# Altium schematic sheet Sheet3.SchDoc
size B; SheetNumber: 1; SheetTotal: 1
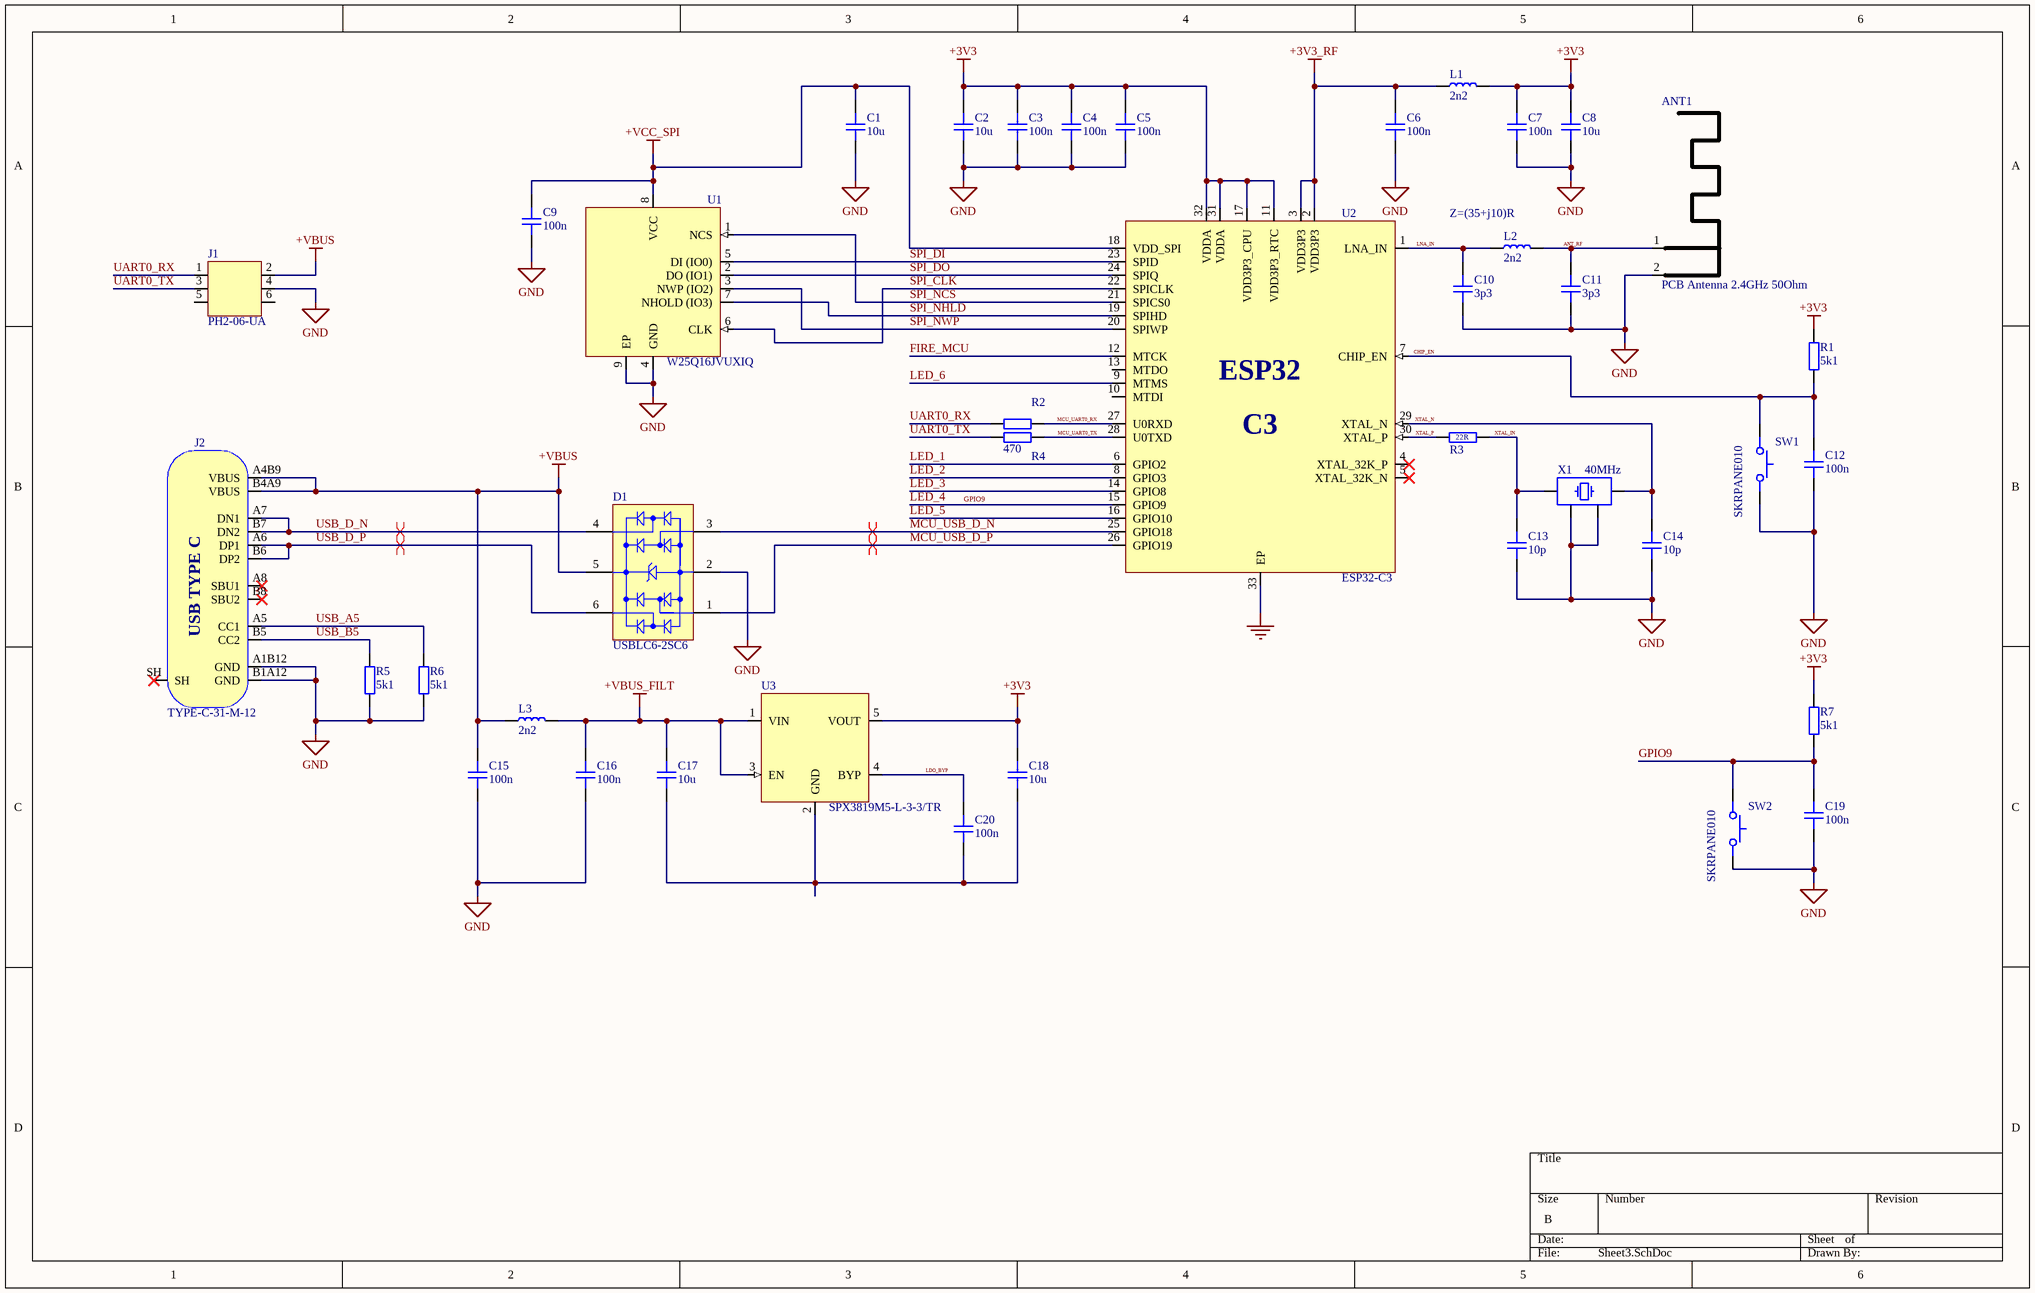
[diagram p0: Sheet3.SchDoc]

## Parts
ANT1  PCB Antenna 2.4GHz 50Ohm  [ANT_IFA_USB_2_4GHZ_50R]  (no BOM)
C1  10u  [CAP_0603]
C2  10u  [CAP_0603]
C3  100n  [CAP_0805]
C4  100n  [CAP_0805]
C5  100n  [CAP_0805]
C6  100n  [CAP_0805]
C7  100n  [CAP_0805]
C8  10u  [CAP_0603]
C9  100n  [CAP_0805]
C10  3p3  [CAP_0402]
C11  3p3  [CAP_0402]
C12  100n  [CAP_0805]
C13  10p  [CAP_0402]
C14  10p  [CAP_0402]
C15  100n  [CAP_0805]
C16  100n  [CAP_0805]
C17  10u  [CAP_0603]
C18  10u  [CAP_0603]
C19  100n  [CAP_0805]
C20  100n  [CAP_0805]
D1  USBLC6-2SC6  [STM-SOT23-6L_V]
J1  PH2-06-UA  [PH2-06-UA]
J2  TYPE-C-31-M-12  [TYPE-C-31-M-12]
L1  2n2  [IND_0402]
L2  2n2  [IND_0402]
L3  2n2  [IND_0402]
R1  5k1  [RES_0805]
R2  470  [RES_0805]  (value not drawn)
R3  22R  [RES_0402]
R4  470  [RES_0805]
R5  5k1  [RES_0805]
R6  5k1  [RES_0805]
R7  5k1  [RES_0805]
SW1  SKRPANE010  [SKRPANE010]
SW2  SKRPANE010  [SKRPANE010]
U1  W25Q16JVUXIQ  [USON-8-2X3MM]
U2  ESP32-C3  [QFN32-5x5]
U3  SPX3819M5-L-3-3/TR  [SOT-23-5]
X1  40MHz  [XTAL_2520]

## Nets
+3V3: C2.2 C3.2 C4.2 C5.2 C7.2 C8.2 C18.2 L1.1 R1.2 R7.2 U2.11(VDD3P3_RTC) U2.17(VDD3P3_CPU) U2.31(VDDA) U2.32(VDDA) U3.5(VOUT)
+3V3_RF: C6.2 L1.2 U2.2(VDD3P3) U2.3(VDD3P3)
+VBUS: C15.2 D1.5(VBUS) J1.2 J2.A4B9(VBUS) J2.B4A9(VBUS) L3.2
+VBUS_FILT: C16.2 C17.2 L3.1 U3.1(VIN) U3.3(EN)
+VCC_SPI: C1.2 C9.2 U1.8(VCC) U2.18(VDD_SPI)
GND: ANT1.2(GND) C1.1 C2.1 C3.1 C4.1 C5.1 C6.1 C7.1 C8.1 C9.1 C10.1 C11.1 C12.1 C13.1 C14.1 C15.1 C16.1 C19.1 D1.2(GND) J1.4 J2.A1B12(GND) J2.B1A12(GND) R5.1 R6.1 SW1.12 SW2.12 U1.4(GND) U1.9(EP) U2.33(EP) X1.2 X1.4
ANT_RF: ANT1.1(RF) C11.2 L2.1
CHIP_EN: C12.2 R1.1 SW1.34 U2.7(CHIP_EN)
FIRE_MCU: U2.12(MTCK)
GPIO9: C19.2 R7.1 SW2.34 U2.15(GPIO9)  [also labelled LED_4]
LDO_BYP: C20.2 U3.4(BYP)
LED_1: U2.6(GPIO2)
LED_2: U2.8(GPIO3)
LED_3: U2.14(GPIO8)
LED_5: U2.16(GPIO10)
LED_6: U2.9(MTMS)
LNA_IN: C10.2 L2.2 U2.1(LNA_IN)
MCU_UART0_RX: R2.1 U2.27(U0RXD)
MCU_UART0_TX: R4.1 U2.28(U0TXD)
MCU_USB_D_N: D1.3(I/O_2) U2.25(GPIO18)
MCU_USB_D_P: D1.1(I/O_1) U2.26(GPIO19)
SPI_CLK: U1.6(CLK) U2.22(SPICLK)
SPI_DI: U1.5(DI_(IO0)) U2.23(SPID)
SPI_DO: U1.2(DO_(IO1)) U2.24(SPIQ)
SPI_NCS: U1.1(NCS) U2.21(SPICS0)
SPI_NHLD: U1.7(NHOLD_(IO3)) U2.19(SPIHD)
SPI_NWP: U1.3(NWP_(IO2)) U2.20(SPIWP)
UART0_RX: J1.1 R2.2
UART0_TX: J1.3 R4.2
USB_A5: J2.A5(CC1) R6.2
USB_B5: J2.B5(CC2) R5.2
USB_D_N: D1.4(I/O_3) J2.A7(DN1) J2.B7(DN2)
USB_D_P: D1.6(I/O_4) J2.A6(DP1) J2.B6(DP2)
XTAL_IN: C13.2 R3.2 X1.3
XTAL_N: C14.2 U2.29(XTAL_N) X1.1
XTAL_P: R3.1 U2.30(XTAL_P)
NetC17_1: C17.1 C18.1 C20.1 U3.2(GND)

Not connected (* = marked no-connect by the designer): J1 5 6; J2 A8(SBU1)* B8(SBU2)* SH*; U2 4(XTAL_32K_P)* 5(XTAL_32K_N)* 10(MTDI) 13(MTDO)

## Layout directives
differential pair; differential pair class DIFF_USB: MCU_USB_D_N, MCU_USB_D_P, USB_D_N, USB_D_P

## Notes on the sheet
- (near L2) Z=(35+j10)R
- (in symbol ESP32-C3) ESP32; C3
- (in symbol TYPE-C-31-M-12) USB TYPE C

## Library data of the parts
ANT1 = ANT_IFA_USB_2_4GHZ_50R: Inverted F 2.4GHz ISM PCB Antenna 50 Ohm; ComponentLink1Description: Datasheet; ComponentLink1URL: https://www.ti.com/lit/an/swra117d/swra117d.pdf
C1 C2 C8 C17 C18 = CAP_0603_10V: Capacitor SMD 0603 10V; Manufacturer: Samsung; Manufacturer Part Number: CL10A106KP8NNNC; LCSC: C19702
C3-C7 C9 C12 C15 C16 C19 C20 = CAP_0805_50V: Capacitor SMD 0805 50V
C10 C11 = CAP_0402_50V: Capacitor SMD 0402 50V; Manufacturer: FH; Manufacturer Part Number: 0402CG3R3C500NT; LCSC: C1565
C13 C14 = CAP_0402_50V: Capacitor SMD 0402 50V; Manufacturer: Samsung; Manufacturer Part Number: CL05C100JB5NNNC; LCSC: C32949
D1 = CMP-2000-05378-1: Very low capacitance ESD protection, 3.5 pF, -40 to 125 degC, 6-Pin SOT23, RoHS, Tape and Reel; Manufacturer: STMicroelectronics; Polarity: Uni-Directional; Clamping Voltage: 17V; Rad Hardened: No; Product Height (mm): 1.3mm; Leakage Current (Max): 0.15uA; Product Length (mm): 3.05mm; Number of Elements: 1; Peak Pulse Current: 5A; Configuration: Dual; Reverse Breakdown Voltage: 6V; Working Voltage (Max): 5V; Capacitance Value: 3.5pF; Suppressor Type: DiodeArrays; Product Depth (mm): 1.75mm; Test Current (It): 1mA; Package / Case: SOT-23; Operating Temperature Max Deg. C: 125C; Package Description: 6-Pin Small Outline Transistor, Body 2.925 x 1.625 mm, Pitch 0.95 mm; Package Reference: SOT23-6L; Datasheet Version: Rev. 5, 10/2011; Operating Temperature Min Deg. C: -40C; Mounting Style: SurfaceMount; Direction Type: Uni-Directional; Mounting: SurfaceMount; Pin Count: 6; Leakage Current: 0.15uA; Packaging: TapeandReel; Operating Temperature Classification: Automotive; Clamping Voltage (Max): 17V; Manufacturer URL: http://www.st.com/; Reverse Stand-off Voltage: 5V; Datasheet URL: http://www.st.com/st-web-ui/static/active/en/resource/technical/document/datasheet/CD00050750.pdf; Working Voltage: 5V; Operating Temp Range: -40Cto125C; LCSC: C7519
J2 = TYPE-C-31-M-12: USB Type C Connector Horizontal SMT; Manufacturer: Koren Hroparts; Manufacturer Part Number: TYPE-C-31-M-12; LCSC: C165948
L1-L3 = IND_0402: Inductor SMD 0402; Manufacturer: Murata; Manufacturer Part Number: LQW15AN2N2G80D; LCSC: C412264
R1 R2 R4-R7 = RES_0805: Resistor SMD 0805; Manufacturer: *; Manufacturer Part Number: *; Distributor Link: *
R3 = RES_0402: Resistor SMD 0402; Manufacturer: UNI-ROYAL; Manufacturer Part Number: 0402WGF220JTCE; LCSC: C25092
SW1 SW2 = SKRPANE010: Tactile Switch SMD SPST; Manufacturer: Alps Alpine; Manufacturer Part Number: SKRPANE010; LCSC: C470426
U1 = W25Q16JVUXIQ: 16M-BIT SERIAL FLASH MEMORY WITH / DUAL/QUAD SPI USON-8; Manufacturer: Winbond; Manufacturer Part Number: W25Q16JVUXIQ; LCSC: C2843335
U2 = ESP32-C3: Ultra­Low­Power SoC with RISC­V Single­Core CPU Supporting IEEE 802.11b/g/n (2.4 GHz Wi­Fi) and Bluetooth® 5 (LE); Manufacturer: Espressif; Manufacturer Part Number: ESP32-C3; LCSC: C2838500
U3 = SPX3819M5-L-3-3/TR: 500mA +3.3V Low-Noise LDO Voltage Regulator; Manufacturer: MaxLinear; Manufacturer Part Number: SPX3819M5-L-3-3/TR; LCSC: C9055
X1 = XTAL_2520: Crystal SMD 2520; Manufacturer: Seiko Epson; Manufacturer Number: Q24FA20H0020900; Frequency: 40MHz; LCSC: C255973